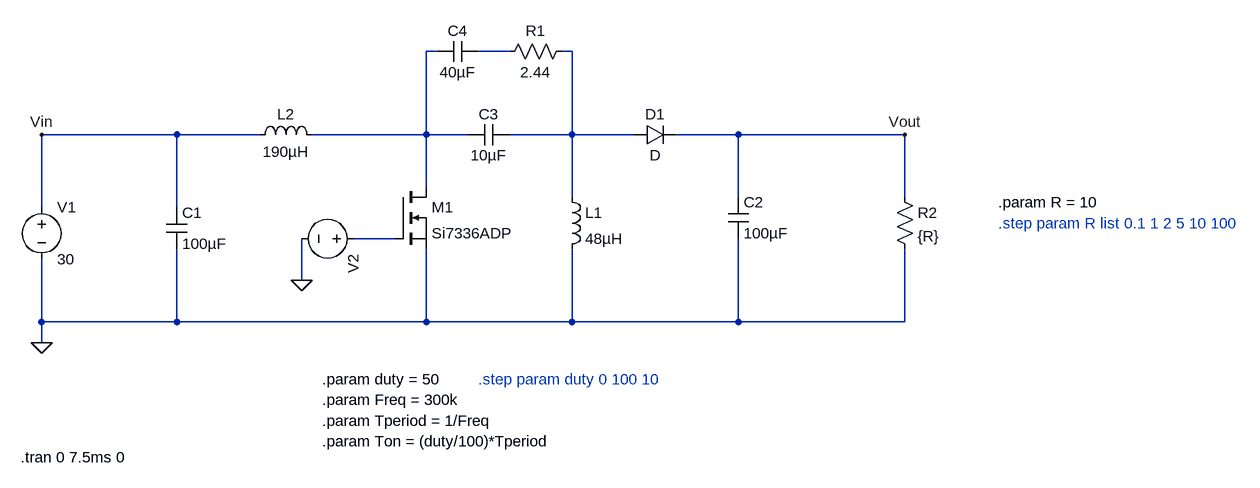
[diagram p0: schematic sepicR1.asc]
sepicR1.asc, the LTspice schematic file:
Version 4
SHEET 1 1508 680
WIRE 240 -64 224 -64
WIRE 352 -64 304 -64
WIRE 448 -64 432 -64
WIRE -160 64 -368 64
WIRE -32 64 -160 64
WIRE 224 64 224 -64
WIRE 224 64 48 64
WIRE 288 64 224 64
WIRE 448 64 448 -64
WIRE 448 64 352 64
WIRE 544 64 448 64
WIRE 704 64 608 64
WIRE 960 64 704 64
WIRE 224 144 224 64
WIRE 448 160 448 64
WIRE 704 160 704 64
WIRE 960 160 960 64
WIRE -368 176 -368 64
WIRE -160 176 -160 64
WIRE 176 224 112 224
WIRE 32 288 32 224
WIRE -368 352 -368 256
WIRE -160 352 -160 240
WIRE -160 352 -368 352
WIRE 224 352 224 240
WIRE 224 352 -160 352
WIRE 448 352 448 240
WIRE 448 352 224 352
WIRE 704 352 704 224
WIRE 704 352 448 352
WIRE 960 352 960 240
WIRE 960 352 704 352
WIRE -368 384 -368 352
FLAG -368 384 0
FLAG 960 64 Vout
FLAG -368 64 Vin
FLAG 32 288 0
SYMBOL voltage -368 160 R0
SYMATTR InstName V1
SYMATTR Value 30
SYMBOL cap -176 176 R0
SYMATTR InstName C1
SYMATTR Value 100µF
SYMBOL nmos 176 144 R0
SYMATTR InstName M1
SYMATTR Value Si7336ADP
SYMBOL voltage 128 224 R90
WINDOW 3 24 96 Invisible 2
WINDOW 123 0 0 Left 0
WINDOW 39 0 0 Left 0
SYMATTR Value PULSE(0 5 0 0 0 {Ton} {Tperiod})
SYMATTR InstName V2
SYMBOL ind 432 144 R0
SYMATTR InstName L1
SYMATTR Value 48µH
SYMBOL cap 688 160 R0
SYMATTR InstName C2
SYMATTR Value 100µF
SYMBOL res 944 144 R0
SYMATTR InstName R2
SYMATTR Value {R}
SYMBOL diode 544 80 R270
WINDOW 0 32 32 VTop 2
WINDOW 3 0 32 VBottom 2
SYMATTR InstName D1
SYMBOL ind -48 80 R270
WINDOW 0 32 56 VTop 2
WINDOW 3 5 56 VBottom 2
SYMATTR InstName L2
SYMATTR Value 190µH
SYMBOL cap 352 48 R90
WINDOW 0 0 32 VBottom 2
WINDOW 3 32 32 VTop 2
SYMATTR InstName C3
SYMATTR Value 10µF
SYMBOL cap 304 -80 R90
WINDOW 0 0 32 VBottom 2
WINDOW 3 32 32 VTop 2
SYMATTR InstName C4
SYMATTR Value 40µF
SYMBOL res 448 -80 R90
WINDOW 0 0 56 VBottom 2
WINDOW 3 32 56 VTop 2
SYMATTR InstName R1
SYMATTR Value 2.44
TEXT 64 536 Left 2 !.param Ton = (duty/100)*Tperiod
TEXT 64 504 Left 2 !.param Tperiod = 1/Freq
TEXT 64 472 Left 2 !.param Freq = 300k
TEXT 64 440 Left 2 !.param duty = 50
TEXT -400 560 Left 2 !.tran 0 7.5ms 0
TEXT 1104 200 Left 2 ;.step param R list 0.1 1 2 5 10 100
TEXT 1104 168 Left 2 !.param R = 10
TEXT 304 440 Left 2 ;.step param duty 0 100 10

The netlist it stands for:
* sepicR1.asc
V1 Vin 0 30
C1 Vin 0 100µF
M1 N001 N004 0 0 Si7336ADP
V2 N004 0 PULSE(0 5 0 0 0 {Ton} {Tperiod})
L1 N003 0 48µH
C2 Vout 0 100µF
R2 Vout 0 {R}
D1 N003 Vout D
L2 Vin N001 190µH
C3 N003 N001 10µF
C4 N002 N001 40µF
R1 N003 N002 2.44
.model D D
.lib standard.dio
.model NMOS NMOS
.model PMOS PMOS
.lib standard.mos
.param Ton = (duty/100)*Tperiod
.param Tperiod = 1/Freq
.param Freq = 300k
.param duty = 50
.tran 0 7.5ms 0
* .step param R list 0.1 1 2 5 10 100
.param R = 10
* .step param duty 0 100 10
.backanno
.end